# Altium project RSD_M1_LED_TURN_LEFT_RIGHT_V2.PrjPcb
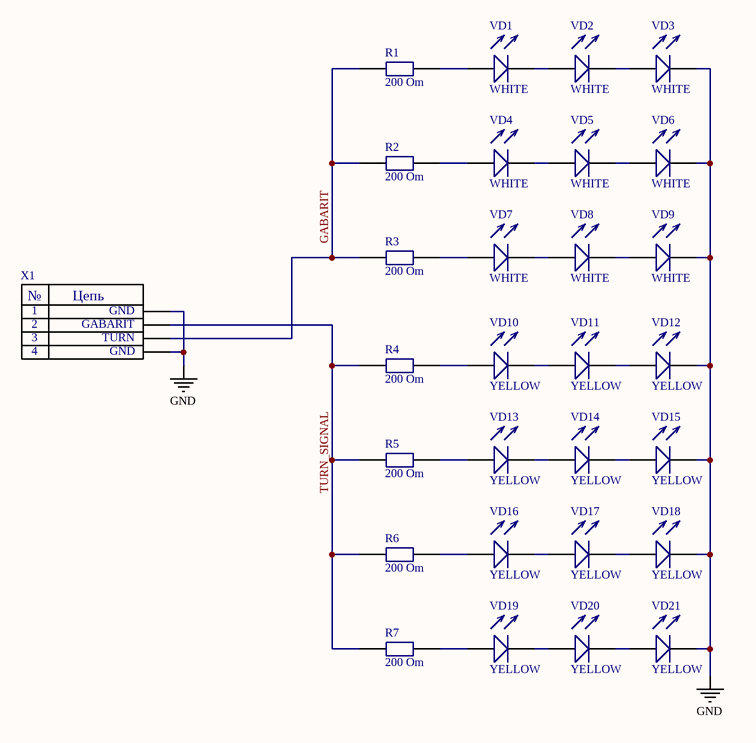
[diagram p0: RSD_M1_LED_TURN_RIGHT_V2.SchDoc]
2 sheets, 58 parts. Net scope: global (net labels, ports and power ports of the same name join across sheets).
Board files: RSD_M1_LED_TURN_RIGHT_V2.PcbDoc, RSD_M1_LED_TURN_LEFT_V2.PcbDoc, RSD_M1_LED_TURN_LEFT_RIGHT_V2.PcbDoc
Sheets:
  RSD_M1_LED_TURN_RIGHT_V2.SchDoc
  RSD_M1_LED_TURN_LEFT_V2.SchDoc

## Sheet RSD_M1_LED_TURN_RIGHT_V2.SchDoc
size A4

### Parts
R1  value 200 Om  [Res0603]  (hidden comment: Resistor)
R2  value 200 Om  [Res0603]  (hidden comment: Resistor)
R3  value 200 Om  [Res0603]  (hidden comment: Resistor)
R4  value 200 Om  [Res0603]  (hidden comment: Resistor)
R5  value 200 Om  [Res0603]  (hidden comment: Resistor)
R6  value 200 Om  [Res0603]  (hidden comment: Resistor)
R7  value 200 Om  [Res0603]  (hidden comment: Resistor)
VD1  value WHITE  [3528_LED]  (hidden comment: LED)
VD2  value WHITE  [3528_LED]  (hidden comment: LED)
VD3  value WHITE  [3528_LED]  (hidden comment: LED)
VD4  value WHITE  [3528_LED]  (hidden comment: LED)
VD5  value WHITE  [3528_LED]  (hidden comment: LED)
VD6  value WHITE  [3528_LED]  (hidden comment: LED)
VD7  value WHITE  [3528_LED]  (hidden comment: LED)
VD8  value WHITE  [3528_LED]  (hidden comment: LED)
VD9  value WHITE  [3528_LED]  (hidden comment: LED)
VD10  value YELLOW  [3528_LED]  (hidden comment: LED)
VD11  value YELLOW  [3528_LED]  (hidden comment: LED)
VD12  value YELLOW  [3528_LED]  (hidden comment: LED)
VD13  value YELLOW  [3528_LED]  (hidden comment: LED)
VD14  value YELLOW  [3528_LED]  (hidden comment: LED)
VD15  value YELLOW  [3528_LED]  (hidden comment: LED)
VD16  value YELLOW  [3528_LED]  (hidden comment: LED)
VD17  value YELLOW  [3528_LED]  (hidden comment: LED)
VD18  value YELLOW  [3528_LED]  (hidden comment: LED)
VD19  value YELLOW  [3528_LED]  (hidden comment: LED)
VD20  value YELLOW  [3528_LED]  (hidden comment: LED)
VD21  value YELLOW  [3528_LED]  (hidden comment: LED)
X1  1: GND  2: GABARIT  3: TURN  [FPC_4_1]  (hidden comment: FPC_connector_4_1)

### Nets
GND: VD3.1 VD6.1 VD9.1 VD12.1 VD15.1 VD18.1 VD21.1 X1.1 X1.4
GABARIT: R1.2 R2.2 R3.2 X1.3
TURN_SIGNAL: R4.2 R5.2 R6.2 R7.2 X1.2
NetR1_1: R1.1 VD1.2
NetR2_1: R2.1 VD4.2
NetR3_1: R3.1 VD7.2
NetR4_1: R4.1 VD10.2
NetR5_1: R5.1 VD13.2
NetR6_1: R6.1 VD16.2
NetR7_1: R7.1 VD19.2
NetVD1_1: VD1.1 VD2.2
NetVD2_1: VD2.1 VD3.2
NetVD4_1: VD4.1 VD5.2
NetVD5_1: VD5.1 VD6.2
NetVD7_1: VD7.1 VD8.2
NetVD8_1: VD8.1 VD9.2
NetVD10_1: VD10.1 VD11.2
NetVD11_1: VD11.1 VD12.2
NetVD13_1: VD13.1 VD14.2
NetVD14_1: VD14.1 VD15.2
NetVD16_1: VD16.1 VD17.2
NetVD17_1: VD17.1 VD18.2
NetVD19_1: VD19.1 VD20.2
NetVD20_1: VD20.1 VD21.2

### Notes on the sheet
- (in symbol FPC_connector_4_1) №; Цепь

### Library data of the parts
X1 = FPC_connector_4_1: Value: 0522070433; 4: GND

## Sheet RSD_M1_LED_TURN_LEFT_V2.SchDoc
size A4
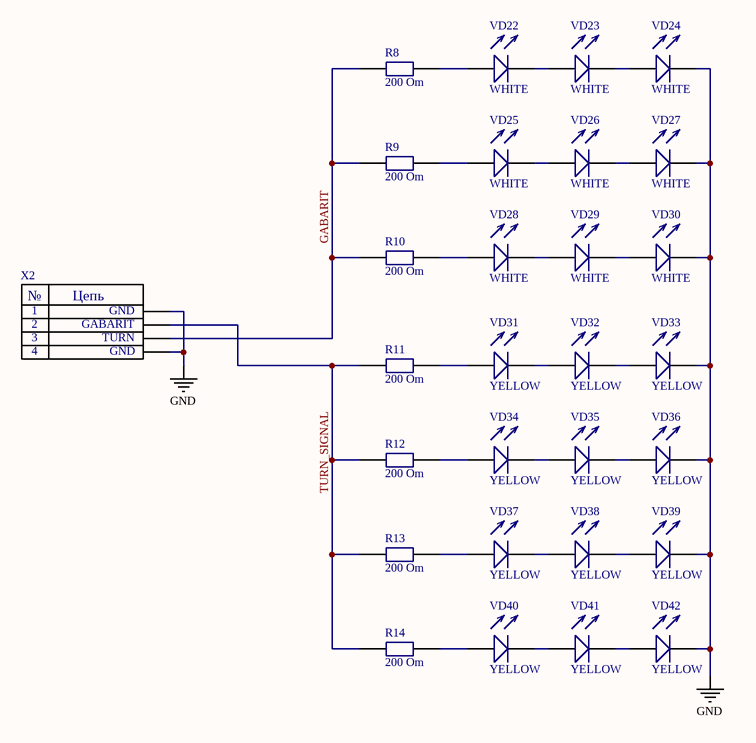
[diagram p1: RSD_M1_LED_TURN_LEFT_V2.SchDoc]

### Parts
R8  value 200 Om  [Res0603]  (hidden comment: Resistor)
R9  value 200 Om  [Res0603]  (hidden comment: Resistor)
R10  value 200 Om  [Res0603]  (hidden comment: Resistor)
R11  value 200 Om  [Res0603]  (hidden comment: Resistor)
R12  value 200 Om  [Res0603]  (hidden comment: Resistor)
R13  value 200 Om  [Res0603]  (hidden comment: Resistor)
R14  value 200 Om  [Res0603]  (hidden comment: Resistor)
VD22  value WHITE  [3528_LED]  (hidden comment: LED)
VD23  value WHITE  [3528_LED]  (hidden comment: LED)
VD24  value WHITE  [3528_LED]  (hidden comment: LED)
VD25  value WHITE  [3528_LED]  (hidden comment: LED)
VD26  value WHITE  [3528_LED]  (hidden comment: LED)
VD27  value WHITE  [3528_LED]  (hidden comment: LED)
VD28  value WHITE  [3528_LED]  (hidden comment: LED)
VD29  value WHITE  [3528_LED]  (hidden comment: LED)
VD30  value WHITE  [3528_LED]  (hidden comment: LED)
VD31  value YELLOW  [3528_LED]  (hidden comment: LED)
VD32  value YELLOW  [3528_LED]  (hidden comment: LED)
VD33  value YELLOW  [3528_LED]  (hidden comment: LED)
VD34  value YELLOW  [3528_LED]  (hidden comment: LED)
VD35  value YELLOW  [3528_LED]  (hidden comment: LED)
VD36  value YELLOW  [3528_LED]  (hidden comment: LED)
VD37  value YELLOW  [3528_LED]  (hidden comment: LED)
VD38  value YELLOW  [3528_LED]  (hidden comment: LED)
VD39  value YELLOW  [3528_LED]  (hidden comment: LED)
VD40  value YELLOW  [3528_LED]  (hidden comment: LED)
VD41  value YELLOW  [3528_LED]  (hidden comment: LED)
VD42  value YELLOW  [3528_LED]  (hidden comment: LED)
X2  1: GND  2: GABARIT  3: TURN  [FPC_4_1]  (hidden comment: FPC_connector_4_1)

### Nets
GND: VD24.1 VD27.1 VD30.1 VD33.1 VD36.1 VD39.1 VD42.1 X2.1 X2.4
GABARIT: R8.2 R9.2 R10.2 X2.3
TURN_SIGNAL: R11.2 R12.2 R13.2 R14.2 X2.2
NetR8_1: R8.1 VD22.2
NetR9_1: R9.1 VD25.2
NetR10_1: R10.1 VD28.2
NetR11_1: R11.1 VD31.2
NetR12_1: R12.1 VD34.2
NetR13_1: R13.1 VD37.2
NetR14_1: R14.1 VD40.2
NetVD22_1: VD22.1 VD23.2
NetVD23_1: VD23.1 VD24.2
NetVD25_1: VD25.1 VD26.2
NetVD26_1: VD26.1 VD27.2
NetVD28_1: VD28.1 VD29.2
NetVD29_1: VD29.1 VD30.2
NetVD31_1: VD31.1 VD32.2
NetVD32_1: VD32.1 VD33.2
NetVD34_1: VD34.1 VD35.2
NetVD35_1: VD35.1 VD36.2
NetVD37_1: VD37.1 VD38.2
NetVD38_1: VD38.1 VD39.2
NetVD40_1: VD40.1 VD41.2
NetVD41_1: VD41.1 VD42.2

### Notes on the sheet
- (in symbol FPC_connector_4_1) №; Цепь

### Library data of the parts
X2 = FPC_connector_4_1: Value: 0522070433; 4: GND

## Nets that join several sheets
GND: RSD_M1_LED_TURN_RIGHT_V2 (9 pins), RSD_M1_LED_TURN_LEFT_V2 (9 pins)
GABARIT: RSD_M1_LED_TURN_RIGHT_V2 (R1.2 R2.2 R3.2 X1.3), RSD_M1_LED_TURN_LEFT_V2 (R8.2 R9.2 R10.2 X2.3)
TURN_SIGNAL: RSD_M1_LED_TURN_RIGHT_V2 (5 pins), RSD_M1_LED_TURN_LEFT_V2 (5 pins)